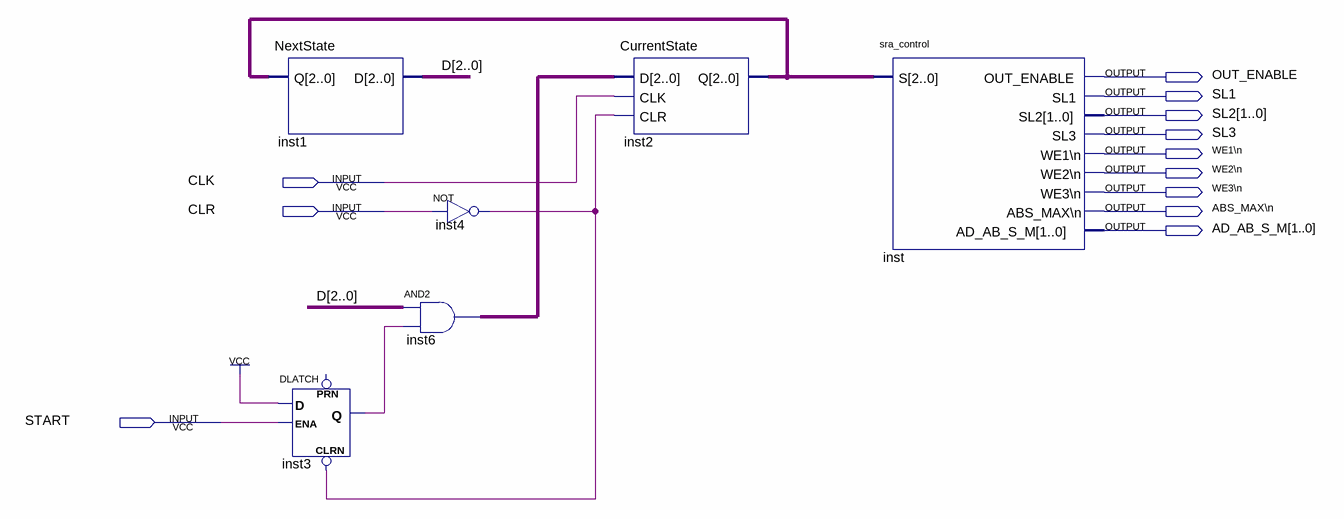
[diagram p0: schematic sheet]
// Quartus schematic SRA_CONTROL_BLOCK.bdf as structural Verilog: 6 symbols, 12 pins
module SRA_CONTROL_BLOCK (
  input  CLK,
  input  CLR,
  input  START,
  output OUT_ENABLE,
  output SL1,
  output [1:0] SL2,
  output SL3,
  output \WE1\n ,
  output \WE2\n ,
  output \WE3\n ,
  output \ABS_MAX\n ,
  output [1:0] AD_AB_S_M
);

  wire inst3_q, inst4_out;
  wire [2:0] D, inst2_q, inst6_out;

  NextState inst1 (.Q(inst2_q), .D(D));
  DLATCH inst3 (.CLRN(inst4_out), .D(1'b1), .ENA(START), .Q(inst3_q));  // open: PRN
  assign inst6_out = D & {3{inst3_q}};  // AND2 inst6, 3 bits wide
  not inst4 (inst4_out, CLR);
  CurrentState inst2 (.D(inst6_out), .CLK(CLK), .CLR(inst4_out), .Q(inst2_q));
  sra_control inst (
    .S(inst2_q), .OUT_ENABLE(OUT_ENABLE), .SL1(SL1), .SL2(SL2), .SL3(SL3), .\WE1\n (\WE1\n ),
    .\WE2\n (\WE2\n ), .\WE3\n (\WE3\n ), .\ABS_MAX\n (\ABS_MAX\n ), .AD_AB_S_M(AD_AB_S_M));
endmodule
